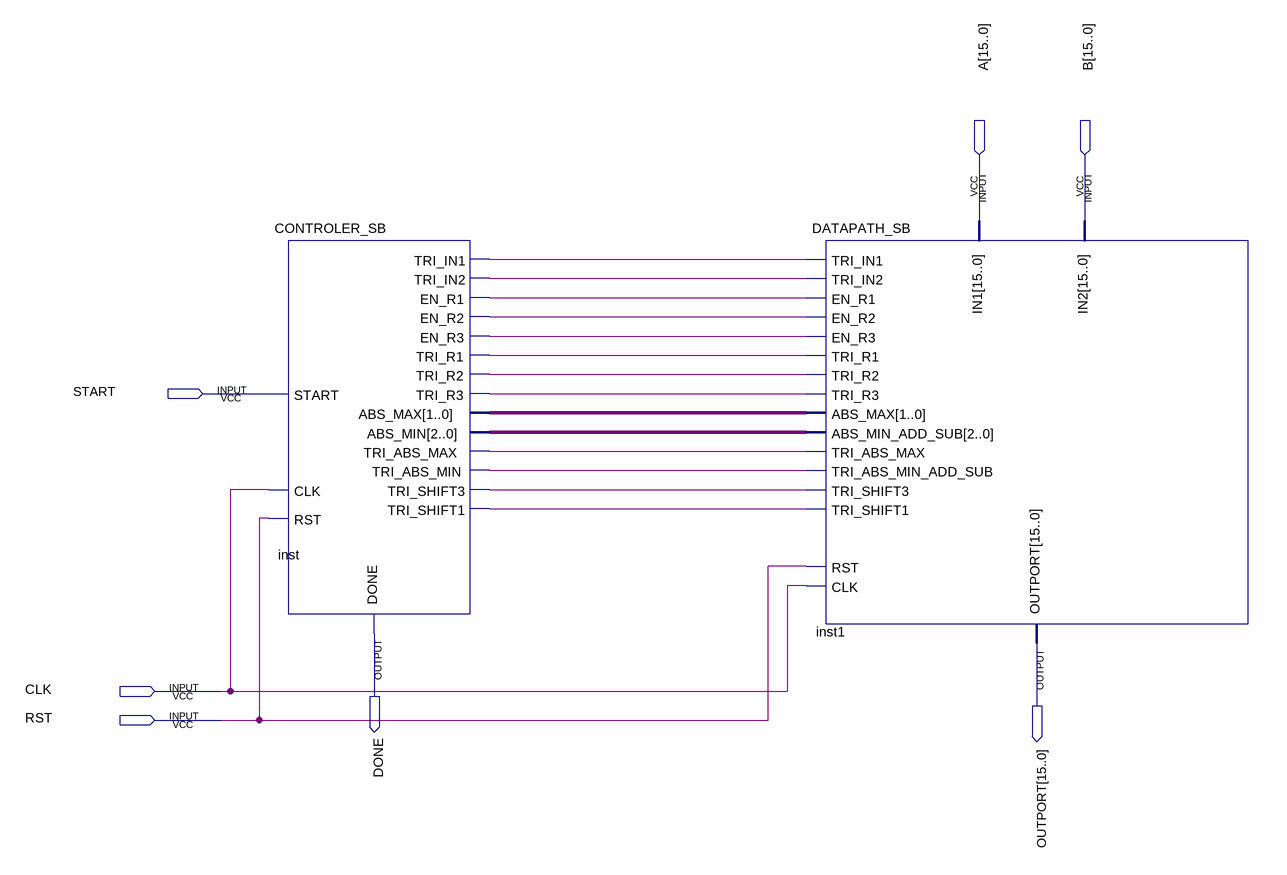
[diagram p0: schematic sheet]
// Quartus schematic SRA_SB.bdf as structural Verilog: 2 symbols, 7 pins
module SRA_SB (
  input  [15:0] A,
  input  [15:0] B,
  input  START,
  input  CLK,
  input  RST,
  output DONE,
  output [15:0] OUTPORT
);

  wire inst_en_r1, inst_en_r2, inst_en_r3, inst_tri_abs_max, inst_tri_abs_min, inst_tri_in1, inst_tri_in2,
       inst_tri_r1, inst_tri_r2, inst_tri_r3, inst_tri_shift1, inst_tri_shift3;
  wire [1:0] inst_abs_max;
  wire [2:0] inst_abs_min;

  CONTROLER_SB inst (
    .START(START), .CLK(CLK), .RST(RST), .TRI_IN1(inst_tri_in1), .TRI_IN2(inst_tri_in2), .EN_R1(inst_en_r1),
    .EN_R2(inst_en_r2), .EN_R3(inst_en_r3), .TRI_R1(inst_tri_r1), .TRI_R2(inst_tri_r2), .TRI_R3(inst_tri_r3),
    .ABS_MAX(inst_abs_max), .ABS_MIN(inst_abs_min), .TRI_ABS_MAX(inst_tri_abs_max),
    .TRI_ABS_MIN(inst_tri_abs_min), .TRI_SHIFT3(inst_tri_shift3), .TRI_SHIFT1(inst_tri_shift1), .DONE(DONE));
  DATAPATH_SB inst1 (
    .TRI_IN1(inst_tri_in1), .TRI_IN2(inst_tri_in2), .EN_R1(inst_en_r1), .EN_R2(inst_en_r2),
    .EN_R3(inst_en_r3), .TRI_R1(inst_tri_r1), .TRI_R2(inst_tri_r2), .TRI_R3(inst_tri_r3),
    .ABS_MAX(inst_abs_max), .ABS_MIN_ADD_SUB(inst_abs_min), .TRI_ABS_MAX(inst_tri_abs_max),
    .TRI_ABS_MIN_ADD_SUB(inst_tri_abs_min), .TRI_SHIFT3(inst_tri_shift3), .TRI_SHIFT1(inst_tri_shift1),
    .IN1(A), .IN2(B), .RST(RST), .CLK(CLK), .OUTPORT(OUTPORT));
endmodule
